# Altium schematic sheet top.SchDoc
size A2; PageSetup: Record=PageOptions|CenterHorizontal=True|CenterVertical=True|PrintScale=0.52|XCorrection=1.00|YCorrection=1.00|PrintKind=0|BorderSize=5000000|LeftOffset=0|BottomOffset=0|Orientation=2|PaperLength=1000|PaperWidth=1000|Scale=100|PaperSource=7|PrintQuality=-4|MediaType=1|DitherType=10|PaperKind=A4|PrintScaleMode=1
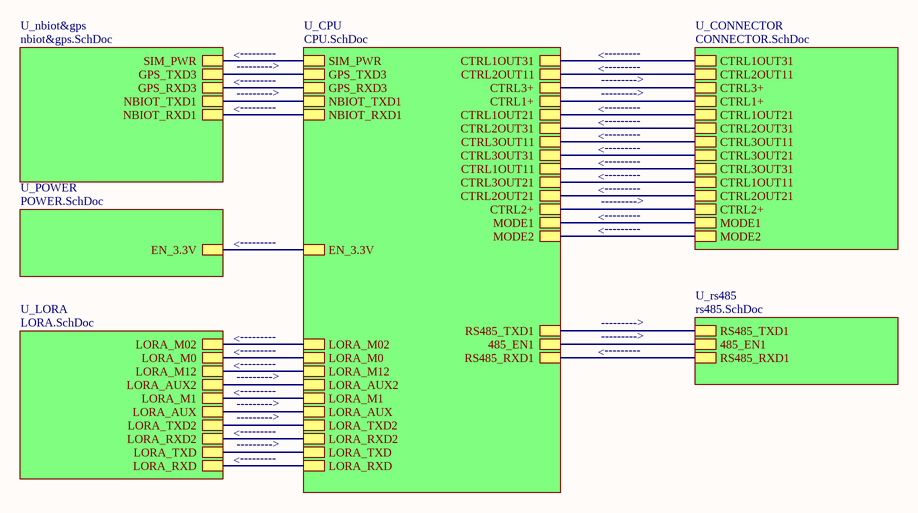
[diagram p0: top.SchDoc]

## Sub-sheets
U_CONNECTOR = CONNECTOR.SchDoc: CTRL1OUT31, CTRL2OUT11, CTRL3+, CTRL1+, CTRL1OUT21, CTRL2OUT31, CTRL3OUT11, CTRL3OUT21, CTRL3OUT31, CTRL1OUT11, CTRL2OUT21, CTRL2+, MODE1, MODE2
U_CPU = CPU.SchDoc: CTRL1OUT21, CTRL1OUT11, LORA_RXD, LORA_TXD, MODE1, MODE2, NBIOT_RXD1, NBIOT_TXD1, EN_3.3V, SIM_PWR, CTRL1OUT31, CTRL2OUT11, LORA_RXD2, LORA_TXD2, CTRL3+, CTRL1+, RS485_TXD1, CTRL2OUT21, CTRL2OUT31, CTRL3OUT11, LORA_AUX, LORA_M1, LORA_AUX2, LORA_M12, LORA_M0, LORA_M02, GPS_RXD3, GPS_TXD3, 485_EN1, CTRL3OUT21, CTRL3OUT31, CTRL2+, RS485_RXD1
U_LORA = LORA.SchDoc: LORA_RXD, LORA_TXD, LORA_RXD2, LORA_TXD2, LORA_AUX, LORA_M1, LORA_AUX2, LORA_M12, LORA_M0, LORA_M02
U_nbiot&gps = nbiot&gps.SchDoc: NBIOT_RXD1, NBIOT_TXD1, GPS_RXD3, GPS_TXD3, SIM_PWR
U_POWER = POWER.SchDoc: EN_3.3V
U_rs485 = rs485.SchDoc: RS485_TXD1, 485_EN1, RS485_RXD1

## Nets
(unnamed): sheet U_LORA/LORA_RXD, sheet U_CPU/LORA_RXD
(unnamed): sheet U_LORA/LORA_TXD, sheet U_CPU/LORA_TXD
(unnamed): sheet U_LORA/LORA_RXD2, sheet U_CPU/LORA_RXD2
(unnamed): sheet U_LORA/LORA_TXD2, sheet U_CPU/LORA_TXD2
(unnamed): sheet U_LORA/LORA_AUX, sheet U_CPU/LORA_AUX
(unnamed): sheet U_LORA/LORA_M1, sheet U_CPU/LORA_M1
(unnamed): sheet U_LORA/LORA_AUX2, sheet U_CPU/LORA_AUX2
(unnamed): sheet U_LORA/LORA_M12, sheet U_CPU/LORA_M12
(unnamed): sheet U_LORA/LORA_M0, sheet U_CPU/LORA_M0
(unnamed): sheet U_LORA/LORA_M02, sheet U_CPU/LORA_M02
(unnamed): sheet U_nbiot&gps/NBIOT_RXD1, sheet U_CPU/NBIOT_RXD1
(unnamed): sheet U_nbiot&gps/NBIOT_TXD1, sheet U_CPU/NBIOT_TXD1
(unnamed): sheet U_nbiot&gps/GPS_RXD3, sheet U_CPU/GPS_RXD3
(unnamed): sheet U_nbiot&gps/GPS_TXD3, sheet U_CPU/GPS_TXD3
(unnamed): sheet U_nbiot&gps/SIM_PWR, sheet U_CPU/SIM_PWR
(unnamed): sheet U_POWER/EN_3.3V, sheet U_CPU/EN_3.3V
(unnamed): sheet U_rs485/RS485_TXD1, sheet U_CPU/RS485_TXD1
(unnamed): sheet U_rs485/485_EN1, sheet U_CPU/485_EN1
(unnamed): sheet U_rs485/RS485_RXD1, sheet U_CPU/RS485_RXD1
(unnamed): sheet U_CPU/CTRL1OUT21, sheet U_CONNECTOR/CTRL1OUT21
(unnamed): sheet U_CPU/CTRL1OUT11, sheet U_CONNECTOR/CTRL3OUT31
(unnamed): sheet U_CPU/MODE1, sheet U_CONNECTOR/MODE1
(unnamed): sheet U_CPU/MODE2, sheet U_CONNECTOR/MODE2
(unnamed): sheet U_CPU/CTRL1OUT31, sheet U_CONNECTOR/CTRL1OUT31
(unnamed): sheet U_CPU/CTRL2OUT11, sheet U_CONNECTOR/CTRL2OUT11
(unnamed): sheet U_CPU/CTRL3+, sheet U_CONNECTOR/CTRL3+
(unnamed): sheet U_CPU/CTRL1+, sheet U_CONNECTOR/CTRL1+
(unnamed): sheet U_CPU/CTRL2OUT21, sheet U_CONNECTOR/CTRL2OUT21
(unnamed): sheet U_CPU/CTRL2OUT31, sheet U_CONNECTOR/CTRL2OUT31
(unnamed): sheet U_CPU/CTRL3OUT11, sheet U_CONNECTOR/CTRL3OUT11
(unnamed): sheet U_CPU/CTRL3OUT21, sheet U_CONNECTOR/CTRL1OUT11
(unnamed): sheet U_CPU/CTRL3OUT31, sheet U_CONNECTOR/CTRL3OUT21
(unnamed): sheet U_CPU/CTRL2+, sheet U_CONNECTOR/CTRL2+

## Notes on the sheet
- --------->